# EAGLE board LiBatteryChargeBoostBoard (EAGLE 9.6.2)
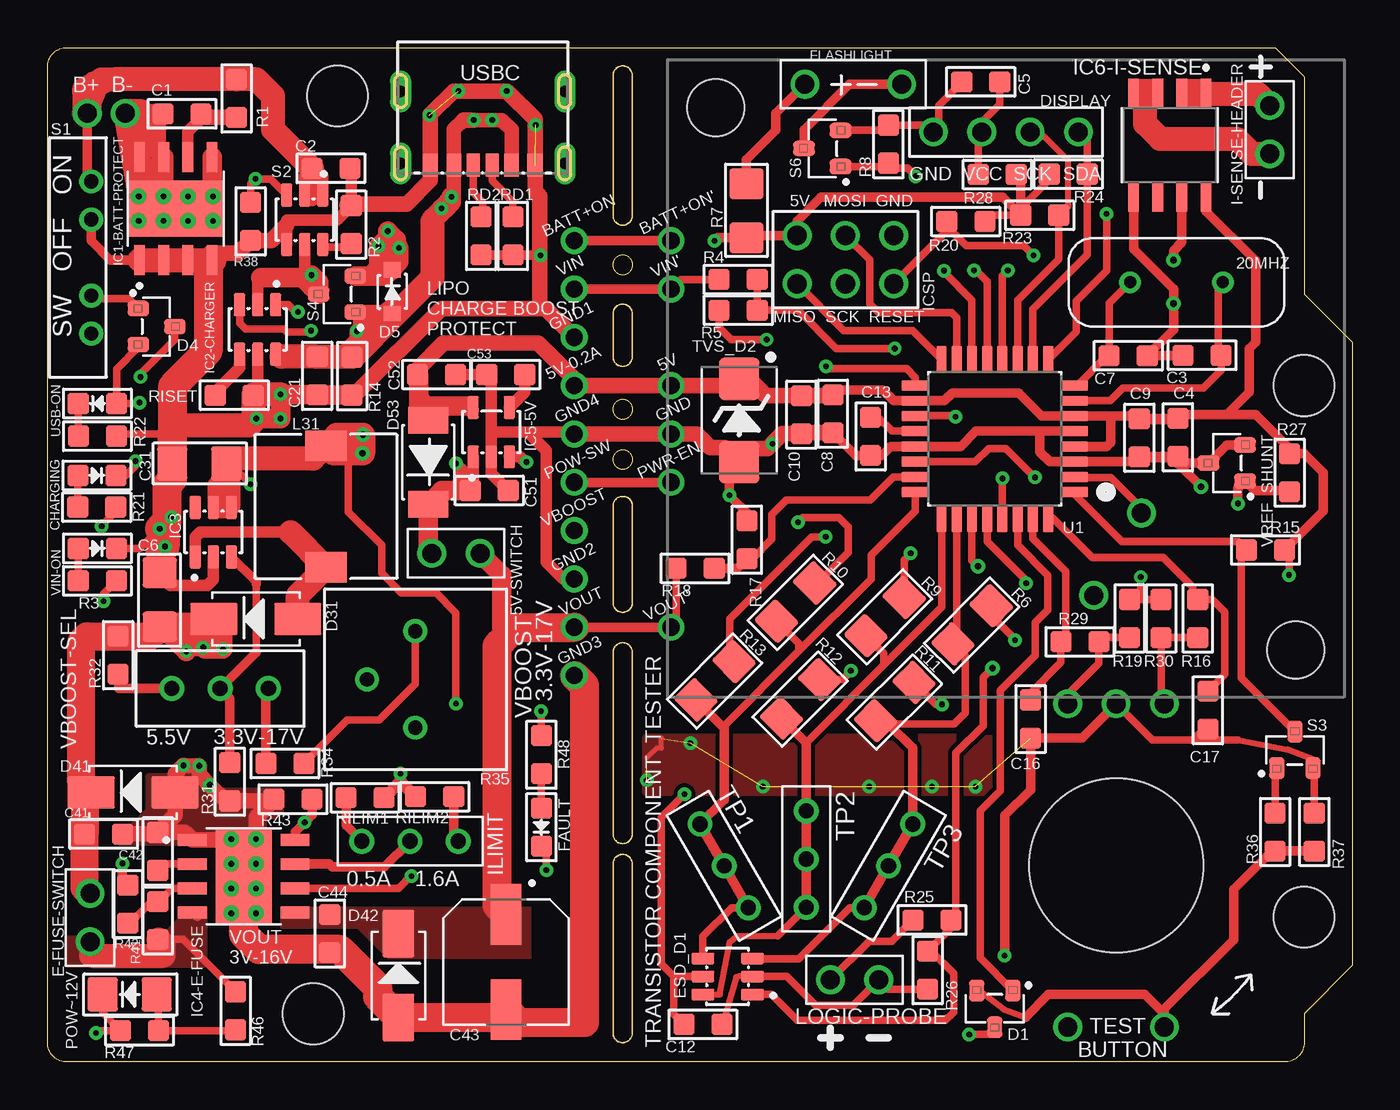
[diagram p1: board, top side]
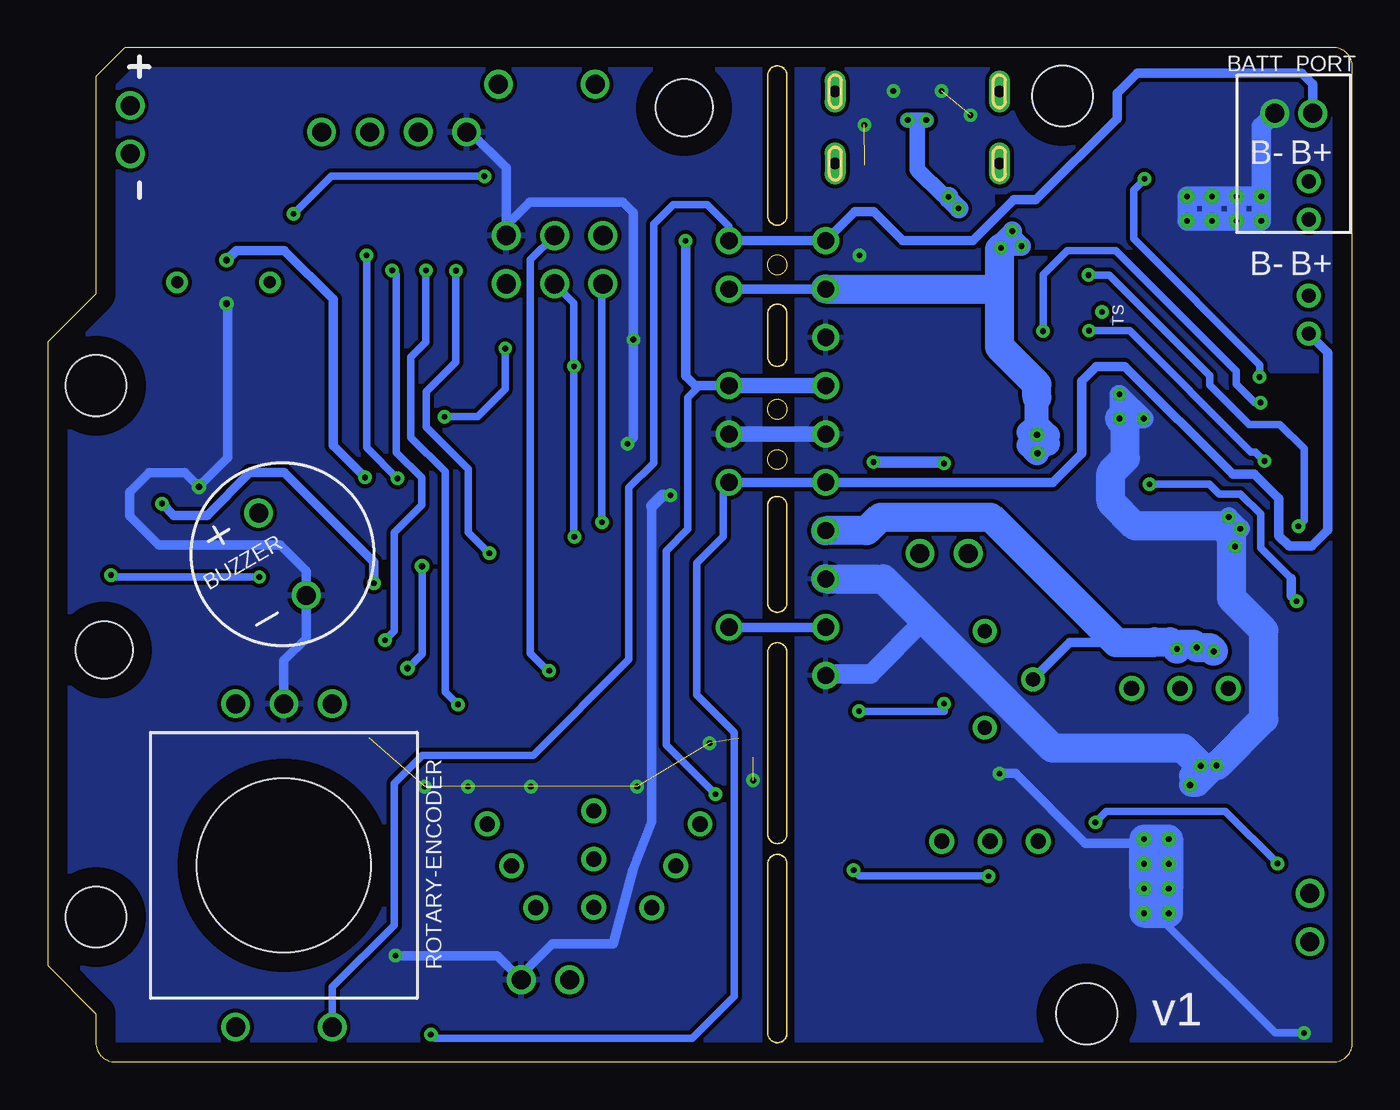
[diagram p2: board, bottom side, seen from below]

Size 68.58 x 53.34 mm. Coordinates in mm from the lower left corner, seen from the top.
Outline: 68.58,5.08 66.04,2.54 66.04,1.02 arc-90 65.02,0 1.02,0 arc-90 0,1.02 0,52.32 arc-90 1.02,53.34 64.52,53.34 66.04,51.82 66.04,40.39 68.58,37.85 68.58,5.08
Copper layers (1*16): Top 0.035mm / dielectric 1.5mm / Bottom 0.035mm
Design rules "default *": minimum track width 6mil, minimum drill 0.3mm, track to track 0.2mm, track to pad 0.2mm, pad to pad 0.2mm, via to via 10mil, smd to smd 0.2mm, copper to edge 40mil, drill to drill 0.5mm, minimum pad ring 10mil, minimum via ring 8mil, stop-mask expansion 4mil, vias tented up to drill 0mil, thermal gap 10mil
Net classes: 0 default: clearance 0.205 mm
Holes 3.2 mm at 15.24,50.8 13.97,2.54 66.04,7.62 66.04,35.56
tKeepout: area 13.2,48.8 to 17.2,52.8; area 12,0.5 to 16,4.5; area 64,5.6 to 68,9.6; area 64,33.6 to 68,37.6
bKeepout: area 13.2,48.8 to 17.2,52.8; area 12,0.5 to 16,4.5; area 64,5.6 to 68,9.6; area 64,33.6 to 68,37.6
Milling: area 29.7,33.8 to 30.7,34.8; area 29.7,31.2 to 30.7,32.2; area 29.7,41.4 to 30.7,42.4; 30 lines

## Footprints (pad centres in the part's own frame; a part is rotated, then mirrored left to right if it is on the bottom)
TEST-POINT-TH-1MM = drill 0.9: P$1 0,0
HEADER-2PIN-0.1"P = drill 1: 1 -1.27,0; 2 1.27,0
XTAL_ECS-200-18-4X-CKM = drill 0.63 pad 1.03: 1 -2.44,0; 2 2.44,0
S2B-PH-K-S = drill 1: N 0.984,-2.54; P -1.016,-2.54
BUZZER-ACTIVE-CMI-9605-0580T = drill 1: P$1 0,2.5; P$2 0,-2.5
0603 = smd 1.1 x 1.1: 1 -1,0; 2 1,0
1206 = smd 1.6 x 1.803: 1 -1.422,0; 2 1.422,0
CAP_EEEFN1E101UP = smd 3.2 x 1.6: 1 -2.5,0; 2 2.5,0
0603-DIODE = smd 1.1 x 1.1: A 1,0; C -1,0
SOT-23-3 = smd 0.8 x 1.13: 1 -0.95,-0.96; 2 0.95,-0.96; 3 0,0.96
SOD-323 = smd 0.8 x 0.9: A -1.16,-0.03; C 1.14,-0.03
SMA = smd 2.5 x 1.7: A -2.205,0; C 2.205,0
SOD-128 = smd 1.4 x 2.1: A -2.11,-0.06; K 2.29,-0.06
DISPLAY-1.3"-SH1106-I2C = drill 1: GND -3.81,-1.27; SCK 1.27,-1.27; SDA 3.81,-1.27; VCC -1.27,-1.27 | hole 3: -15.24,0; 15.24,-28.5
SOT-23-6 = smd 1.2 x 0.6: 1 -1.3,0.95; 2 -1.3,0; 3 -1.3,-0.95; 4 1.3,-0.95; 5 1.3,0; 6 1.3,0.95
HEADER-2PIN-0.2"P = drill 1: +VE -2.54,0; -VE 2.54,0
SOIC-8-POWER-PAD = smd 1.55 x 0.6: 1 -2.7,1.905; 2 -2.7,0.635; 3 -2.7,-0.635; 4 -2.7,-1.905; 5 2.7,-1.905; 6 2.7,-0.635; 7 2.7,0.635; 8 2.7,1.905 | smd 2.95 x 4.9: 9 0,0 | drill 0.3: 10 -0.65,1.95; 11 0.65,1.95; 12 -0.65,0.65; 13 0.65,0.65; 14 -0.65,-0.65; 15 0.65,-0.65; 16 -0.65,-1.95; 17 0.65,-1.95
SOT-23-5 = smd 1.2 x 0.6: 1 -1.3,0.95; 2 -1.3,0; 3 -1.3,-0.95; 4 1.3,-0.95; 5 1.3,0.95
SOIC-8 = smd 1.55 x 0.6: 1 -2.7,1.905; 2 -2.7,0.635; 3 -2.7,-0.635; 4 -2.7,-1.905; 5 2.7,-1.905; 6 2.7,-0.635; 7 2.7,0.635; 8 2.7,1.905
HEADER-ICSP-0.1"P = drill 1.016: GND 2.54,1.27; MISO -2.54,-1.27; MOSI 0,1.27; RESET 2.54,-1.27; SCK 0,-1.27; VCC -2.54,1.27
HEADER-3PIN-0.1"P = drill 0.8: 1 -2.54,0; 2 0,0; 3 2.54,0
INDUCTOR-SMRH74-220MT = smd 2.2 x 1.6: P$1 0,3.2; P$2 0,-3.2
1206-DIODE = smd 1.6 x 1.803: A 1.422,0; C -1.422,0
ROTARY-POTENTIOMETER-3386P = drill 0.75: 1 2.54,0; 2 0,-2.54; 3 -2.54,0
PEC12R-3217F-S0024 = drill 1: 1 -2.54,8.5; 2 2.54,8.5; A -2.54,-8.5; B 2.54,-8.5; C 0,-8.5 | hole 9.144: 0,0
CSS-1310MC = drill 0.75: 1 -4,0; 2 -2,0; 3 4,0; C 2,0
DIOM5336X244N = smd 2.22 x 2.13: A 2.19,0; C -2.19,0
TQFP32 = smd 1.47 x 0.55: 1 -4.17,2.8; 2 -4.17,2; 3 -4.17,1.2; 4 -4.17,0.4; 5 -4.17,-0.4; 6 -4.17,-1.2; 7 -4.17,-2; 8 -4.17,-2.8; 17 4.17,-2.8; 18 4.17,-2; 19 4.17,-1.2; 20 4.17,-0.4; 21 4.17,0.4; 22 4.17,1.2; 23 4.17,2; 24 4.17,2.8 | smd 0.55 x 1.47: 9 -2.8,-4.17; 10 -2,-4.17; 11 -1.2,-4.17; 12 -0.4,-4.17; 13 0.4,-4.17; 14 1.2,-4.17; 15 2,-4.17; 16 2.8,-4.17; 25 2.8,4.17; 26 2,4.17; 27 1.2,4.17; 28 0.4,4.17; 29 -0.4,4.17; 30 -1.2,4.17; 31 -2,4.17; 32 -2.8,4.17
USB-C-RECEPTABLE-1016435900011LF = smd 0.7 x 1.2: A5 -0.5,3.03; B5 0.5,3.03 | smd 0.76 x 1.2: A9 1.52,3.03; B9 -1.52,3.03 | smd 0.8 x 1.2: A12 2.75,3.03; B12 -2.75,3.03 | drill 0.6 pad 1.1 long: SH1 -4.32,2.95; SH2 4.32,2.95; SH3 -4.32,-0.85; SH4 4.32,-0.85
SLW-883935-2A-D = drill 0.8: 1 -2.54,0; 2 2.54,0; C 0,0

## Placement (x,y rotation side)
5V  TEST-POINT-TH  [TEST-POINT-TH-1MM]  32.77,35.56 0 top
5V-0.2A  TEST-POINT-TH  [TEST-POINT-TH-1MM]  27.69,35.56 70 top
5V-SWITCH  [HEADER-2PIN-0.1"P]  21.46,26.75 180 top
20MHZ  ECS-200-18-4X-CKM  [XTAL_ECS-200-18-4X-CKM]  59.33,41 0 top
BATT+ON  TEST-POINT-TH  [TEST-POINT-TH-1MM]  27.69,43.18 70 top
BATT+ON'  TEST-POINT-TH  [TEST-POINT-TH-1MM]  32.77,43.18 0 top
BATT_PORT  S2B-PH-K-S  [S2B-PH-K-S]  3.1,47.34 180 bottom
BUZZER  CMI-9605-0580T  [BUZZER-ACTIVE-CMI-9605-0580T]  56.24,26.7 30 bottom
C1  0.1uF  [0603]  7.07,49.85 180 top
C2  1uF  [0603]  14.89,46.99 180 top
C3  22pF  [0603]  60.68,37.16 0 top
C4  10uF  [0603]  59.41,32.84 270 top
C5  10uF  [0603]  49.05,51.54 180 top
C6  22uF-35V  [1206]  5.89,24.31 270 top
C7  22pF  [0603]  56.79,37.13 180 top
C8  100nF  [0603]  41.27,34.09 90 top
C9  100nF  [0603]  57.38,32.82 270 top
C10  10uF  [0603]  39.62,34.04 270 top
C12  10uF  [0603]  34.44,1.98 0 top
C13  1nF  [0603]  43.26,32.89 270 top
C16  100nF  [0603]  51.66,18.03 270 top
C17  100nF  [0603]  60.99,18.49 270 top
C21  1uF  [0603]  14.17,36.08 90 top
C31  22uF-15V  [1206]  7.98,31.47 0 top
C41  0.1uF  [0603]  2.95,11.99 180 top
C42  10nF  [0603]  5.79,11.07 270 top
C43  100uF  [CAP_EEEFN1E101UP]  24.1,5.26 270 top
C44  10uF  [0603]  14.83,6.76 90 top
C51  10uF-25V  [0603]  23.22,30.05 180 top
C52  10uF  [0603]  20.45,36.14 180 top
C53  10nFC0G  [0603]  24.08,36.14 0 top
CHARGING  BLUE  [0603-DIODE]  2.59,30.84 180 top
D1  PMBD6100  [SOT-23-3]  49.78,2.79 180 top
D4  PMBD6100  [SOT-23-3]  5.73,38.67 270 top
D5  CUS10S30  [SOD-323]  18.09,40.51 90 top
D31  SS34  [SMA]  10.95,23.29 180 top
D41  SMAJ15A  [SMA]  4.5,14.17 180 top
D42  SS34  [SMA]  18.44,4.55 90 top
D53  PMEG3010EP  [SOD-128]  20.07,31.62 270 top
DISPLAY  [DISPLAY-1.3"-SH1106-I2C]  50.37,50.16 0 top
E-FUSE-SWITCH  [HEADER-2PIN-0.1"P]  2.24,7.59 270 top
ESD_D1  SRV05-4MR6  [SOT-23-6]  35.74,4.5 180 top
FAULT  RED  [0603-DIODE]  25.96,12.34 90 top
FLASHLIGHT  HEADER-2PIN-0.2"P  [HEADER-2PIN-0.2"P]  42.34,51.41 0 top
GND  TEST-POINT-TH  [TEST-POINT-TH-1MM]  32.77,33.02 0 top
GND1  TEST-POINT-TH  [TEST-POINT-TH-1MM]  27.69,38.1 70 top
GND2  TEST-POINT-TH  [TEST-POINT-TH-1MM]  27.69,25.4 70 top
GND3  TEST-POINT-TH  [TEST-POINT-TH-1MM]  27.69,20.32 70 top
GND4  TEST-POINT-TH  [TEST-POINT-TH-1MM]  27.69,33.02 70 top
I-SENSE-HEADER  CES-102-02-G-S-RA  [HEADER-2PIN-0.1"P]  64.24,49.02 270 top
IC1-BATT-PROTECT  XB8089D  [SOIC-8-POWER-PAD]  6.74,44.87 90 top
IC2-CHARGER  BQ21040DB  [SOT-23-6]  11.04,38.52 270 top
IC3  MT3608  [SOT-23-6]  8.71,27.86 90 top
IC4-E-FUSE  TPS259630  [SOIC-8-POWER-PAD]  10.3,9.77 0 top
IC5-5V  LP2992IM5-5.0  [SOT-23-5]  23.32,33.12 90 top
IC6-I-SENSE  TMCS1108A4B  [SOIC-8]  58.98,48.21 270 top
ICSP  CES-103-01-T-D  [HEADER-ICSP-0.1"P]  41.94,42.19 0 top
ILIMIT  [HEADER-3PIN-0.1"P]  19.05,11.61 0 top
L31  22uH  [INDUCTOR-SMRH74-220MT]  14.63,29.21 0 top
LOGIC-PROBE  [HEADER-2PIN-0.1"P]  42.42,4.32 0 top
POW-SW  TEST-POINT-TH  [TEST-POINT-TH-1MM]  27.69,30.48 70 top
POW~12V  RED  [1206-DIODE]  4.32,3.56 0 top
PWR-EN  TEST-POINT-TH  [TEST-POINT-TH-1MM]  32.77,30.48 0 top
R1  1K  [0603]  9.94,50.67 90 top
R2  10K  [0603]  15.96,44.03 90 top
R3  3K3  [0603]  2.62,25.3 0 top
R4  10K  [0603]  36.3,41.15 0 top
R5  3K3  [0603]  36.3,39.52 180 top
R6  680  [1206]  48.59,22.99 225 top
R7  51  [1206]  36.73,44.75 90 top
R8  100K  [0603]  44.2,48.26 90 top
R9  680  [1206]  44.02,23.42 225 top
R10  680  [1206]  39.32,24.18 225 top
R11  470k  [1206]  44.53,18.95 225 top
R12  470k  [1206]  39.57,19.1 225 top
R13  470k  [1206]  35.08,20.04 225 top
R14  10K  [0603]  16,36.07 90 top
R15  100K  [0603]  64.01,26.92 180 top
R16  10K  [0603]  60.45,23.32 90 top
R17  3K3  [0603]  36.75,27.46 270 top
R18  10K  [0603]  34.04,25.96 180 top
R19  10K  [0603]  56.87,23.32 90 top
R20  10K  [0603]  48.26,44.2 180 top
R21  1K  [0603]  2.59,29.18 0 top
R22  620  [0603]  2.62,32.91 180 top
R23  3.3K  [0603]  52.15,44.53 180 top
R24  3.3K  [0603]  53.64,46.69 180 top
R25  10K  [0603]  46.48,7.47 180 top
R26  3.3K  [0603]  46.25,4.83 90 top
R27  10K  [0603]  65.28,30.99 270 top
R28  68R  [0603]  49.91,46.66 0 top
R29  10K  [0603]  54.25,22.1 180 top
R30  10K  [0603]  58.52,23.32 90 top
R31  2.2K  [0603]  9.58,14.73 270 top
R32  20K  [0603]  3.71,21.39 270 top
R34  10K-1%  [0603]  12.47,15.7 180 top
R35  50K  [ROTARY-POTENTIOMETER-3386P]  19.33,20.12 270 top
R36  10K  [0603]  64.52,12.09 270 top
R37  22K  [0603]  66.57,12.09 270 top
R38  7K5  [0603]  10.67,44.2 90 top
R41  82K5  [0603]  5.79,7.44 270 top
R42  38K3  [0603]  4.22,8.31 270 top
R43  10K  [0603]  12.9,13.82 0 top
R46  3K3  [0603]  9.88,2.69 90 top
R47  1K  [0603]  4.83,1.65 0 top
R48  470  [0603]  25.96,16.15 90 top
RD1  5K1-1%  [0603]  24.46,43.43 90 top
RD2  5K1-1%  [0603]  22.78,43.43 90 top
RILIM1  1K8-1%  [0603]  16.69,13.89 180 top
RILIM2  560-1%  [0603]  20.35,13.94 0 top
RISET  1K5-0.36A  [0603]  9.81,35.06 0 top
ROTARY-ENCODER  PEC12R-3217F-S0024  [PEC12R-3217F-S0024]  56.16,10.34 180 top
S1  POWER-SWITCH  [CSS-1310MC]  2.29,42.3 270 top
S2  TPS22995H  [SOT-23-6]  13.51,44.29 270 top
S3  BC847C  [SOT-23-3]  65.56,16.41 0 top
S4  DMP1045U  [SOT-23-3]  15.21,40.38 90 top
S6  AS2312  [SOT-23-3]  40.72,48.03 90 top
TP1  [HEADER-3PIN-0.1"P]  35.56,10.31 300 top
TP2  [HEADER-3PIN-0.1"P]  39.88,10.67 270 top
TP3  [HEADER-3PIN-0.1"P]  44.2,10.31 240 top
TVS_D2  SMBJP6KE6.8A  [DIOM5336X244N]  36.35,33.73 270 top
U1  ATMEGA328P-AU-TQFP  [TQFP32]  49.78,32.77 180 top
USB-ON  ORANGE  [0603-DIODE]  2.62,34.62 0 top
USBC  10164359-00011LF  [USB-C-RECEPTABLE-1016435900011LF]  22.87,50.19 180 top
VBOOST  TEST-POINT-TH  [TEST-POINT-TH-1MM]  27.69,27.94 70 top
VBOOST-SEL  [SLW-883935-2A-D]  9.07,19.63 0 top
VIN  TEST-POINT-TH  [TEST-POINT-TH-1MM]  27.69,40.64 70 top
VIN'  TEST-POINT-TH  [TEST-POINT-TH-1MM]  32.77,40.64 0 top
VIN-ON  GREEN  [0603-DIODE]  2.62,27 180 top
VOUT  TEST-POINT-TH  [TEST-POINT-TH-1MM]  27.69,22.86 70 top
VOUT'  TEST-POINT-TH  [TEST-POINT-TH-1MM]  32.77,22.86 0 top
VREF_SHUNT  LM4040AELT-2.5  [SOT-23-3]  61.98,31.5 90 top

## Tracks (layer width: path | path; a pad name or v marks a point on that pad's centre or on a via)
5V  (via drill 0.3)
  Top 0.406: R24.2 52.65,46.41 51.15,44.91 R23.2 49.59,44.53 R20.1 | R28.2 51.15,46.42 | R30.2 R19.2 57.08,24.32 57.45,24.69 v57.45,25.5 | R15.1 65.25,26.68 v65.25,25.6 | v33.48,14.09 32.26,12.87 32.26,5.16 32.92,4.5 | ESD_D1.5 32.92,4.5 | C12.1 32.92,2.5 32.92,4.5
  Top 0.508: 51.15,46.42 R23.2 50.21,45.47 40.64,45.47 39.4,44.22 ICSP.VCC 36.85,43.46 R7.1 35.2,43.33 v35.05,43.18 | 41.53,35.34 43.91,35.34 44.48,34.77 U1.18 47.14,34.77 47.54,35.17 51.05,35.17 52.25,33.97 U1.6 55.88,33.97 | 55.88,33.97 57.23,33.97 | 59.38,33.82 C4.1 59.6,34.04 61.98,34.04 | 65.1,31.81 R27.1 | D53.A 20.56,34.29 | 22.37,34.29 IC5-5V.5 22.09,34.7 | C52.2 19.45,35.24 | U1.4 55.67,32.37 55.88,32.57 55.88,33.97 | IC6-I-SENSE.8 60.88,44.75 63.5,42.13 63.5,37.84 63.17,37.51 63.17,35.23 61.98,34.04 | R15.1 67.06,28.97 67.06,30.99 66.06,31.99 R27.1 | R27.1 65.11,32.16 | R27.1 65.28,32.26 63.51,34.04 61.98,34.04
  Top 0.559: C8.2 41.53,35.34 | 57.23,33.97 C9.1 | C9.1 59.38,33.82 | 57.12,33.82 C9.1
  Top 0.61: 20.56,34.29 22.37,34.29 | 22.09,34.7 19.98,34.7 19.45,35.24
  Top 0.813: C8.2 41.22,35.04 C10.1 37.74,35.04 36.85,35.92 TVS_D2.C 35.99,35.56 5V.P$1 5V-0.2A.P$1 27.94,35.64 25.78,37.8 20.8,37.8 19.45,36.44 C52.2 | D53.A 19.5,34.24
  Top 1.016: 19.5,34.24 19.5,36.09 C52.2
  Bottom 0.406: v65.25,25.6 65.15,25.5 v57.45,25.5 | 5V.P$1 34.29,35.56 34.92,34.92 34.92,28.02 36.07,26.87 36.07,16.68 v33.48,14.09
  Bottom 0.508: v35.05,43.18 35.05,36.07 34.54,35.56 5V.P$1
  Bottom 0.813: 5V-0.2A.P$1 5V.P$1
!FLT  (via drill 0.3)
  Top 0.406: v19.13,9.78 19.1,9.78 18.46,9.13 IC4-E-FUSE.6 | FAULT.C 26.21,11.09 v26.21,10.08
  Bottom 0.406: v26.21,10.08 25.91,9.78 v19.13,9.78
+VE
  Top 0.406: LOGIC-PROBE.1 43.18,6.35 44.36,6.35 R25.2
A
  Top 0.406: ROTARY-ENCODER.A 58.52,19.02 R30.1 R16.1
AREF
  Top 0.406: U1.20 44.39,33.17 43.66,33.89 C13.1
B
  Top 0.406: ROTARY-ENCODER.B 53.62,19.33 55.25,20.96 R29.1 55.47,22.32 R19.1
BATT+  (via drill 0.3)
  Top 0.406: v2.85,28.17 2.85,28.21 3.59,28.95 R21.2
  Top 0.61: 13.11,41.25 13.51,41.66 S2.5 13.51,41.38 v13.87,41.38 | 11.2,41.25 11.04,41.09 IC2-CHARGER.2
  Top 1.016: S4.3 13.87,40.76 v13.87,41.38 | v13.87,41.38 13.74,41.25 13.38,41.25 | S4.3 13.38,41.25 | v13.87,41.38 14.25,41 S4.3 | 11.2,41.25 13.38,41.25
  Bottom 0.406: v13.87,41.38 12.78,41.38 7.49,36.09 7.49,35.59 5.44,33.53 3.81,33.53 2.54,32.26 2.54,28.47 v2.85,28.17
BATT-
  Top 0.406: 6.1,45.53 6.74,44.9 IC1-BATT-PROTECT.9 7.43,45.56 8.64,45.56
  Top 1.016: 6.04,49.88 C1.2 | C1.2 5.71,49.5 5.71,47.96 IC1-BATT-PROTECT.7 | IC1-BATT-PROTECT.8 4.83,47.42 5.44,46.81 6.1,47.47 IC1-BATT-PROTECT.7 | 6.59,45.26 6.1,45.26 6.1,45.53 | IC1-BATT-PROTECT.7 6.1,45.53 | 6.1,45.53 IC1-BATT-PROTECT.13 | IC1-BATT-PROTECT.11 4.83,45.56 IC1-BATT-PROTECT.8 | IC1-BATT-PROTECT.8 4.83,49.88 C1.2 | IC1-BATT-PROTECT.5 8.64,45.56 IC1-BATT-PROTECT.17 | IC1-BATT-PROTECT.9 7.13,45.26
  Top 1.27: BATT_PORT.N 4.83,45.56
  Top 1.524: BATT_PORT.N 4.83,49.88
  Bottom 1.016: BATT_PORT.N 4.79,49.18 IC1-BATT-PROTECT.11 | IC1-BATT-PROTECT.11 IC1-BATT-PROTECT.13 | IC1-BATT-PROTECT.13 IC1-BATT-PROTECT.15 | IC1-BATT-PROTECT.15 IC1-BATT-PROTECT.17 IC1-BATT-PROTECT.16 IC1-BATT-PROTECT.14 | IC1-BATT-PROTECT.14 IC1-BATT-PROTECT.15 | IC1-BATT-PROTECT.14 IC1-BATT-PROTECT.12 | IC1-BATT-PROTECT.12 IC1-BATT-PROTECT.10 IC1-BATT-PROTECT.11 | IC1-BATT-PROTECT.13 IC1-BATT-PROTECT.12
  pour Bottom (no thermals): -0.2,54.15 -0.2,36.25 4.27,36.25 10.77,42.75 17.91,42.75 18.06,42.9 18.06,45.26 16.46,45.26 12.37,49.35 12.37,54.36 0,54.36
BATT_EN  (via drill 0.3)
  Top 0.406: D4.3 6.7,37.98 4.88,36.16 v4.88,36.02 | S2.3 11.72,46.43 v10.92,46.43 10.67,46.18 R38.2
  Bottom 0.406: v10.92,46.43 11.51,45.85 11.51,43.28 4.88,36.65 v4.88,36.02
BATTP_ALWAYS_ON
  Top 0.508: BATT_PORT.P 2.08,46.51 S1.1 | BATT+ON.P$1 BATT+ON'.P$1 | C2.2 14.08,46.99
  Top 0.61: 13.87,45.49 14.36,45.49 S2.1 14.46,46.6 14.08,46.99 | 13.87,45.59 S2.2 13.51,46.6 C2.2
  Top 1.016: R1.2 | 3.51,51.66 2.06,51 | BATT_PORT.P 2.75,51.46 2.84,51.66 | C2.2 13.87,46.96 13.87,45.59 13.87,45.49
  Top 1.27: 2.06,51.08 2.44,51.46 2.75,51.46 | 2.84,51.66 3.51,51.66 R1.2 | R1.2 10.97,51.67 11.84,50.8 11.84,49.04 C2.2
  Top 1.524: BATT_PORT.P 2.06,49.91 2.06,51 2.06,51.08
  Bottom 0.406: BATT+ON'.P$1 32.77,43.94 33.91,45.09 35.69,45.09 36.73,44.04 36.73,31.5 38.02,30.2 38.02,21.16 43.05,16.13 48.9,16.13 50.37,14.66 50.37,7.19 53.62,3.94 ROTARY-ENCODER.2
  Bottom 0.508: BATT_PORT.P 2.08,51.42 2.67,52 11.3,52 12.37,50.94 12.37,49.61 16.64,45.34 17.8,45.34 19.96,43.18 23.62,43.18 25.15,44.7 26.16,44.7 BATT+ON.P$1 BATT+ON'.P$1
BJT-B
  Top 0.406: R36.1 64.52,15.36 S3.1
BUZZER
  Top 0.406: 53.99,30.73 55.88,30.73 57.49,29.13 BUZZER.P$1
  Top 0.508: U1.2 53.99,30.73
BYP1
  Top 0.61: IC5-5V.4 25.08,35.23 C53.2
CHG  (via drill 0.3)
  Top 0.406: IC2-CHARGER.3 10.09,38.86 10.41,38.53 12.45,38.53 12.6,38.37 13.76,38.37 v13.84,38.46 | CHARGING.C 4.1,30.84 4.62,31.36 v4.62,31.6
  Bottom 0.406: v13.84,38.46 11.71,38.46 5.33,32.08 5.11,32.08 v4.62,31.6
DISPLAY_VCC
  Top 0.406: R28.1 48.91,48.71 DISPLAY.VCC 49.1,49.4 50.05,50.35 C5.1
DVDT
  Top 0.406: C42.2 6.12,10.4 IC4-E-FUSE.2
EN/UVLO
  Top 0.406: IC4-E-FUSE.3 6.54,9.13 5.85,8.44 R41.1 5.49,8.44 4.35,7.31 R42.2
ENC_A
  Top 0.406: U1.32 52.84,28.6 54.92,26.52 58.65,26.52 60.2,24.97 60.2,24.57 R16.2 61.21,24.32 61.87,23.66 61.87,20.38 C17.1
ENC_B
  Top 0.406: U1.31 51.78,27.52 53.51,25.79 53.51,22.35 R29.2 53.25,21 51.66,19.41 C16.1
FB
  Top 0.406: 10.97,25.15 10.97,21.54
  Top 0.508: R31.1 9.58,19.13 VBOOST-SEL.C 10.97,21.54 | IC3.3 10.97,25.25 10.97,25.15
FL+
  Top 0.508: FLASHLIGHT.+VE 38.28,49.89 38.28,48.99 36.73,47.44 R7.2
FL-
  Top 0.508: S6.3 39.76,49.03 42.14,51.41 FLASHLIGHT.-VE
FLASHLIGHT_SIGNAL  (via drill 0.3)
  Top 0.406: S6.1 44.02,47.08 R8.1 44.45,47.01 45.2,47.01 v45.63,46.58 | U1.9 54.06,38.41 54.06,40.01 55.66,41.62 v55.66,44.59
  Bottom 0.406: v55.66,44.59 53.67,46.58 v45.63,46.58
GND  (via drill 0.3, 0.35)  (9 unrouted)
  Top 0.254: 32.26,17.02 32.26,16.51 32,16.51 31.5,16
  Top 0.305: C4.2 59.41,31.94 | ESD_D1.2 36.3,4.5 36.19,4.46 35.52,2.11 C12.2 | S3.2 66.51,15.91 65.13,16.43 62.55,16.93
  Top 0.406: R22.1 3.72,33.01 6.21,33.01 6.55,32.66 C31.1 | C5.2 48.05,51.51 46.83,50.29 46.83,49.16 DISPLAY.GND 46.19,49.26 R8.2 43.92,48.98 S6.2 | ROTARY-ENCODER.C 58.06,16.93 60.2,16.93 | ESD_D1.2 38.86,4.5 40.39,2.97 42.34,2.97 LOGIC-PROBE.2 44.18,3.83 R26.1 | POW~12V.C 2.9,2.58 R47.1 2.67,1.65 v2.54,1.52 | R5.2 35.3,38.62 35.93,37.98 v37.8,37.98 | VIN-ON.C 4.85,27 v5.89,28.04 | R37.1 66.57,15.38 S3.2 | 60.2,16.93 62.55,16.93 | 60.2,16.93 60.76,17.49 C17.2
  Top 0.508: S1.2 2.29,43.17 3.3,42.17 IC1-BATT-PROTECT.1 | 59.38,31.82 C4.2 | C9.2 57.13,31.57 U1.3 52.66,31.57 52.15,32.08 52.15,33.17 | v50.29,5.59 50.32,5.61 50.32,12.96 51.66,14.31 C16.2 54.37,17.03 ROTARY-ENCODER.C | 5.89,25.6 C6.1 | C8.1 42.47,31.89 C13.2 43.83,31.89 44.3,32.37 U1.21 47.99,32.37 48.79,33.17 52.15,33.17 | 15.96,46.92 C2.1 | RD1.1 25.86,42.43 | RD1.1 RD2.1 | R17.1 36.93,28.71 v35.84,29.79 35.84,31.03 TVS_D2.A | RD1.1 25.89,42.43 v25.91,42.42 | C4.2 59.44,31.82 59.44,31.45 v60.63,30.25 | C3.1 59.66,37.13 C7.1 59.18,38.52 v59.18,39.88 59.18,40.64 57.07,42.75 IC6-I-SENSE.5 | U1.5 52.15,33.17 | C4.2 59.76,31.5 VREF_SHUNT.3 61.97,32.45 VREF_SHUNT.2
  Top 0.559: C9.2 59.38,31.82
  Top 0.61: S2.4 12.56,43.99 12.56,44.27 15.21,44.27 R2.2 | IC2-CHARGER.5 11.04,35.28 10.83,35.08 | IC3.2 8.71,25.38 8.38,25.04 6.45,25.04 5.89,25.6 | C51.1 23.32,30.95 IC5-5V.2 23.32,33.12 | GND2.P$1 27.1,25.4 26.21,26.29 26.21,32.16 25.25,33.12 | RILIM1.1 18.54,14.75 | 18.54,14.75 v18.54,15.16 | RILIM2.1 18.54,14.75 | 23.32,33.12 25.25,33.12 | 25.25,33.12 27.84,33.12 GND4.P$1 | 15.73,45.05 15.71,45.03 R2.2 | R2.2 15.96,46.92 | 23.32,33.12 23.32,35.91 C53.1 C52.1
  Top 0.762: 6.55,33.22 6.81,33.48
  Top 0.813: IC1-BATT-PROTECT.4 9,42.52 10,42.52 R38.1 11.77,43.2 12.56,43.99 | C8.1 39.67,33.09 C10.2 38.62,33.04 v38.1,32.51 37.85,32.26 37.06,32.26 TVS_D2.A 35.59,32.3 34.82,32.3 34.11,33.02 GND.P$1 GND4.P$1 | GND1.P$1 27.71,38.1 26.19,39.62 25.86,39.62 | 25.86,39.62 25.86,42.43 25.86,45.52 25.62,45.75 USBC.B12 25.62,49.56 v24.13,51.05 v21.59,51.05 21.34,51.05 20.12,49.84 USBC.A12 20.12,46.36 18.87,45.11 15.79,45.11 15.73,45.05 | R14.1 16.13,35.07 20.68,39.62 25.86,39.62 | IC4-E-FUSE.11 10.96,12.87 R43.1 11.82,13.73 R31.2 9.36,13.73 v8.53,14.55 7.98,15.11 v7.98,15.57 v7.14,15.6 6.7,15.16 D41.A 6.7,12.98 C42.1 | C41.1 5.71,11.99 C42.1 | C42.1 7.21,12.07 IC4-E-FUSE.1 9.61,11.68 IC4-E-FUSE.10
  Top 1.016: IC4-E-FUSE.9 IC4-E-FUSE.14 | 10.3,8.47 IC4-E-FUSE.16 | 11.1,5.92 11.26,5.76 C44.1 14.99,5.92 15.37,5.92 | v10.97,33.83 v12.24,33.83 v12.24,35.1 14.15,35.1 C21.1 R14.1
  Top 1.27: IC1-BATT-PROTECT.1 IC1-BATT-PROTECT.2 IC1-BATT-PROTECT.3 IC1-BATT-PROTECT.4 | 10.83,35.08 RISET.2 | 6.81,33.48 10.62,33.48 v10.97,33.83 10.83,33.98 10.83,35.08 | v12.24,35.1 10.86,35.1 10.83,35.08
  Top 1.524: IC1-BATT-PROTECT.4 8.44,41.97 8.44,37.4 6.55,35.51 C31.1 | C31.1 6.55,33.22 | C31.1 6.55,30.63 6.27,30.35 6.27,28.42 v5.89,28.04 6.17,27.76 v6.17,27.1 5.92,26.85 5.92,25.75 C6.1 | GND3.P$1 28.23,19.78 28.23,2.07 24.79,2.07 C43.2 23.69,2.34 D42.A 17.35,3.43 17.35,3.94 15.37,5.92 11.1,5.92 10.3,6.71 10.3,8.47 IC4-E-FUSE.15
  Bottom 0.406: v2.54,1.52 4.06,1.52 9.65,7.12 IC4-E-FUSE.16
  Bottom 0.508: IC4-E-FUSE.11 11.18,11.49 14.03,11.49 17.7,15.16 v18.54,15.16 | DISPLAY.GND 46.35,48.9 44.48,47.02 ICSP.GND 44.48,43.97 43.23,45.21 38.35,45.21 37.8,44.65 v37.8,37.98 37.8,32.82 v38.1,32.51 | ROTARY-ENCODER.C 56.16,21.11 54.99,22.28 BUZZER.P$2 54.99,25.8 56.36,27.18 62.74,27.18 64.26,28.7 64.26,29.97 63.25,30.99 61.37,30.99 v60.63,30.25 59.11,31.77 59.11,39.8 v59.18,39.88 | 36.83,29.23 36.83,12.63 37.8,10.16 38.86,6.22 42.05,6.22 43.69,4.59 LOGIC-PROBE.2 44.96,5.59 v50.29,5.59
  Bottom 0.61: v35.84,29.79 36.27,29.79 36.83,29.23
  Bottom 0.813: GND4.P$1 GND.P$1
  Bottom 1.016: 6.6,27.69 6.6,28.19 6.6,28.55 v6.5,28.65 v5.89,28.04 6.17,27.76 v6.17,27.1 6.68,27.61 6.6,27.69 | 6.6,27.69 6.35,27.94 | 11.94,33.53 11.63,33.83 v10.97,33.83 v12.24,35.1 v12.24,33.83 | 22.49,23.23 25.32,20.39 27.61,20.39 GND3.P$1
  Bottom 1.27: v7.98,15.57 8.48,15.06 8.48,14.58 8.15,14.58 v7.14,15.6
  Bottom 1.524: v7.14,15.6 7.11,15.57 4.65,18.03 4.65,22.68 6.35,24.38 6.35,27.94 | v7.98,15.57 8.91,16.51 15.77,16.51 22.49,23.23 24.66,25.4 GND2.P$1 | IC4-E-FUSE.14 IC4-E-FUSE.16 IC4-E-FUSE.17 IC4-E-FUSE.15 | IC4-E-FUSE.14 IC4-E-FUSE.15 | IC4-E-FUSE.15 IC4-E-FUSE.13 | IC4-E-FUSE.13 IC4-E-FUSE.11 IC4-E-FUSE.10 IC4-E-FUSE.12 | IC4-E-FUSE.12 IC4-E-FUSE.13 | IC4-E-FUSE.12 IC4-E-FUSE.14 | v12.24,33.83 11.94,33.53 11.94,31.75 12.7,30.99 12.7,29.46 11.43,28.19 6.6,28.19
  other vias: 31.5,14.81 33.78,16.76 37.59,14.48 43.18,14.48 46.48,14.48 48.77,14.48 20.07,49.78 25.65,49.28
  pour Bottom: 29.21,54.36 29.21,-1.27 28.96,-1.52 -0.51,-1.52 -1.02,-1.02 -1.02,35.87 4.35,35.87 10.72,42.24 18.62,42.24 18.84,42.46 18.9,45.75 16.81,45.8 12.88,49.73 12.88,54.36
  pour Bottom: 31.17,54.13 31.17,0.33 32.51,-1.02 70.87,-1.02 70.87,54.13
  pour Top (no thermals): 3.81,12.19 4.32,12.19 5.33,13.21 5.33,14.99 6.35,14.99 6.6,15.24 7.87,15.24 7.87,14.99 8.64,14.22 12.19,14.22 12.19,13.21 11.94,12.95 11.33,12.95 11.33,11.58 3.81,11.58
  pour Top: 31.5,17.02 31.5,14.48 49.78,14.48 49.78,17.02
  pour Top: 31.5,17.02 31.5,14.22 50.04,14.22 50.04,17.02
I2C-SCL
  Top 0.305: 52.15,48.9 53.62,47.42 53.62,45
  Top 0.406: DISPLAY.SCK 52.15,48.9 | 53.62,45 R23.1 53.15,42.22 50.98,40.06 U1.11
I2C-SDA
  Top 0.406: DISPLAY.SDA 54.65,48.43 R24.1 54.65,42.45 51.78,39.59 U1.10
I_MEASURE  (via drill 0.3, 0.35)
  Top 0.406: U1.22 48.77,31.57 49.46,32.26 50.37,32.26 v51.89,30.73
  Top 0.508: v59.18,42.16 59.18,42.67 59.61,43.1 IC6-I-SENSE.7
  Bottom 0.508: v51.89,30.73 53.57,32.41 53.57,40.11 56.13,42.67 58.67,42.67 v59.18,42.16
ILM
  Top 0.508: ILIMIT.2 17.7,10.25 14.96,10.25 14.81,10.4 IC4-E-FUSE.7
ILM1
  Top 0.508: ILIMIT.1 15.69,12.43 RILIM1.2
ILM2
  Top 0.508: RILIM2.2 21.34,11.85 ILIMIT.3
IN+
  Top 0.508: 60.86,50.94 IC6-I-SENSE.1 60.88,51.44 59.61,51.44 IC6-I-SENSE.2 59.64,50.94 60.86,50.94
  Top 0.61: IC6-I-SENSE.1 60.88,50.63 60.68,50.43 59.74,50.43 59.61,50.55 IC6-I-SENSE.2
  Top 1.27: IC6-I-SENSE.1 63.62,50.91 I-SENSE-HEADER.1
IN-
  Top 0.61: 57.68,51.06 57.68,50.91 IC6-I-SENSE.4 57.07,51.4 58.34,51.4 IC6-I-SENSE.3
  Top 1.27: I-SENSE-HEADER.2 63.3,47.75 62.51,48.54 58.47,48.54 57.68,49.33 57.68,51.06
ISET
  Top 0.61: RISET.1 8.81,35.23 10.09,36.5 IC2-CHARGER.4
N$1
  Top 0.406: USBC.B5 22.37,45.7 22.86,45.21 22.86,44.51 RD2.2
N$2
  Top 0.406: USBC.A5 23.37,46.33 24.46,45.24 RD1.2
N$3
  Top 0.406: USB-ON.C R22.2
N$4
  Top 0.508: VBOOST-SEL.1 3.73,19.63 R32.2
N$5
  Top 0.406: R3.1 VIN-ON.A
N$7
  Top 0.406: R48.1 FAULT.A
N$10
  Top 0.406: CHARGING.A R21.1
N$13
  Top 0.508: R34.2 11.47,19.5 VBOOST-SEL.2
N$18
  Top 0.406: POW~12V.A 5.83,3.47 R47.2 9.84,1.65 R46.1
N$21
  Top 0.406: R34.1 15.76,17.98 17.42,17.98 19.33,19.89 R35.3
OVLO  (via drill 0.3)
  Top 0.406: R42.1
  Top 0.508: v3.94,10.44 3.94,9.59 R42.1 | IC4-E-FUSE.8 13.01,12.09 v13.51,12.6 13.9,12.99 R43.2
  Bottom 0.406: v3.94,10.44 6.68,13.18 12.93,13.18 v13.51,12.6
POWER_EN_SOFT  (via drill 0.3)
  Top 0.406: v48.44,1.45 49.45,1.45 49.45,1.5 D1.3
  Top 0.508: POW-SW.P$1 PWR-EN.P$1
  Bottom 0.406: PWR-EN.P$1 33.07,30.18 33.07,27.64 34.47,26.24 34.47,19.3 32.49,17.32 32.49,3.46 34.71,1.24 48.23,1.24 v48.44,1.45
  Bottom 0.508: S1.3 1.29,37.31 1.29,27.96 2.13,27.13 3.33,27.13 3.86,27.66 3.86,29.62 5.16,30.91 6.3,30.91 11.96,36.58 13.46,36.58 14.22,35.81 14.22,32 15.75,30.48 POW-SW.P$1 PWR-EN.P$1
POWER_EN_TB
  Top 0.305: D1.2 49,3.75 50.27,2.77 51.4,2.35
  Top 0.508: R37.2 R36.2 64.35,11.09 62.33,9.07 62.33,6.43 58.7,2.79 ROTARY-ENCODER.1 58.7,2.52 57.67,3.56 52.6,3.56 51.4,2.35
PWR_CTRL
  Top 0.406: U1.30 50.98,27.17 52.58,25.58 52.58,23.77 51.92,23.11 51.92,21.39 50.06,19.53 50.06,14.25 49.02,13.21 49.02,5.47 D1.1
PWR_SW
  Top 0.406: D4.1 4.27,40.13 2.47,40.13 S1.C
RESET  (via drill 0.3)
  Top 0.406: ICSP.RESET 47.26,43.7 R20.2 47.26,43.94 48.28,42.93 51.31,42.93 v51.82,42.42 | v50.19,30.68 v50.18,30.68 U1.29
  Bottom 0.406: v51.82,42.42 51.82,32.31 v50.19,30.68
RT
  Top 0.406: R2.1 15.77,42.84 14.62,42.84 S2.6
SW
  Top 0.61: IC3.1 7.76,27.61 8.02,27.86 12.78,27.86
  Top 1.27: 12.78,27.86 L31.P$2 13.15,24.53 D31.A
TEST_BUTTON
  Top 0.406: S3.3 62.74,20.19 62.74,26.55 63.01,26.82 R15.2 62.57,27.36 56.46,27.36 53.95,29.87 U1.1
TP1
  Top 0.406: R10.2 39.48,22.01 39.48,21.6 | 39.48,21.6 43.28,25.4 43.28,26.64 45.61,28.98 U1.24 | ESD_D1.4 34.44,6.6 35.95,8.11 TP1.3 | 39.48,21.6 35.56,17.68
  Top 0.508: 35.56,17.55 35.56,13.78 TP1.1 TP1.2 TP1.3 | 35.56,17.55 35.56,17.68 | 35.56,17.55 R13.2
TP1_470K/SCK  (via drill 0.3)
  Top 0.406: R13.1 35.85,21.27 35.85,23.31 40.16,27.61 v40.89,27.61 | U1.17 45.61,36 45.16,36.45 41.05,36.45 v40.92,36.58
  Bottom 0.406: ICSP.SCK 40.92,39.9 v40.92,36.58 40.92,27.64 v40.89,27.61
TP1_680/MISO  (via drill 0.3)
  Top 0.406: U1.16 45.46,38.46 41.85,38.46 ICSP.MISO | v39.45,28.37 39.7,28.63 41.58,28.63 42.08,28.13 42.08,26.79 40.48,25.19 R10.1
  Bottom 0.406: ICSP.MISO 39.45,40.87 v39.45,28.37
TP2
  Top 0.305: 38.38,6.63 36.25,6.63 35.85,6.3 35.34,3.55 ESD_D1.6
  Top 0.406: R9.2 43.95,21.47 43.95,20.89 | 43.95,20.89 43.95,20.86 39.88,16.79 | 43.95,20.89 46.98,23.92 U1.25 | 38.38,6.63 TP2.3
  Top 0.508: TP2.3 TP2.2 TP2.1 39.88,16.79 | 39.88,16.79 | 39.88,16.79 R12.2
TP2_470K/MOSI  (via drill 0.3)
  Top 0.406: U1.15 47.78,39.13 47.52,39.4 43.69,39.4 43.2,39.88 43.2,42.19 ICSP.MOSI | v42.22,20.57 42.22,20.52 41.8,20.11 R12.1
  Bottom 0.406: ICSP.MOSI 43.2,42.19 43.2,21.49 42.29,20.57 v42.22,20.57
TP2_680/SIGNAL_OUT  (via drill 0.3)
  Top 0.406: v45.36,26.75 45.02,26.41 R9.1 | v47.12,41.6 47.12,41.53 48.58,40.06 U1.14
  Bottom 0.406: v47.12,41.6 47.12,36.8 48.67,35.26 48.67,33.38 46.47,31.18 46.47,27.85 v45.36,26.75
TP3
  Top 0.406: U1.26 47.78,28.59 47.78,22.17 R6.2 48.22,21.35 48.22,18.35 47.65,17.78 44.2,17.78 | TP3.3 42.15,8.11 39.47,5.44 37.05,5.44 ESD_D1.3
  Top 0.508: TP3.3 TP3.2 TP3.1 45.47,16.51 44.2,17.78 44.03,17.94 R11.2
TP3_470K  (via drill 0.3)
  Top 0.406: R11.1 46.69,18.8 v47.02,18.8 | v48.69,41.63 48.79,41.63 49.38,41.04 U1.13
  Bottom 0.406: v47.02,18.8 47.69,19.47 47.69,31.05 49.48,32.84 49.48,37.06 48.69,37.85 v48.69,41.63
TP3_680  (via drill 0.3)
  Top 0.406: R6.1 49.6,23.48 50.85,22.23 v50.85,22.17 | U1.12 50.18,41.34 v50.47,41.63
  Bottom 0.406: v50.47,41.63 50.24,41.4 50.24,32.05 48.92,30.73 48.92,29.29 50.37,27.84 50.37,22.66 v50.85,22.17
TP_LOGIC  (via drill 0.35)
  Top 0.406: v49.66,20.7 49.17,20.22 49.17,17.68 47.74,16.24 47.74,7.72 R25.1 47.48,7.05 R26.2 46.46,5.83 47.62,4.66 47.62,2.62 47.19,2.18 39.4,2.18 38.03,3.55 ESD_D1.1 | U1.27 48.58,26.37 v48.9,26.06
  Bottom 0.406: v48.9,26.06 48.9,21.46 v49.66,20.7
TS  (via drill 0.3)
  Top 0.406: IC2-CHARGER.1 12.66,39.82 13.03,39.45 v13.16,39.45
USBV  (via drill 0.3)
  Top 0.406: D4.2 4.78,37.58 3.63,36.44 3.63,34.64 USB-ON.A 4.78,34.62 v4.83,34.67
  Top 0.61: IC2-CHARGER.6 12.03,37.18 12.19,37.18
  Top 0.762: 21.84,49.53 21.35,49.04 USBC.A9 21.35,45.62 v21.22,45.49 | v22.4,49.53 v23.37,49.53 23.88,49.53 24.39,49.02 USBC.B9 | 18.04,39.43 S4.1 16.42,39.17 16.42,38.6 v16.26,38.43 16.26,37.32 R14.2 16,37.23
  Top 0.813: 21.84,49.53 v22.4,49.53
  Top 1.016: 12.29,37.08 12.19,37.18 | 21.22,45.2 20.9,44.88 v20.7,44.88 | 21.22,45.2 v21.22,45.49 | v20.7,44.88 21.02,45.2 21.22,45.2 | v20.7,44.88 20.7,44.68 20.22,44.2 20.22,44.4 v20.7,44.88
  Top 1.27: 12.29,37.08 C21.2 14.18,37.07 R14.2 | 20.22,44.2 20.22,41.25 18.32,39.35 D5.A 18.04,39.43
  Top 1.524: D5.A 16,37.23
  Bottom 0.406: v4.83,34.67 5.13,34.67 6.1,35.64 6.1,36.32 12.45,42.67 14.99,42.67 16.26,41.4 v16.26,38.43
  Bottom 0.813: v20.7,44.88 21.31,45.49 | 21.31,45.49 21.39,45.57 21.51,45.57 22.86,46.91 22.86,49.53 | 22.86,49.53 v23.37,49.53 v22.4,49.53 22.86,49.53 | v21.22,45.49 21.31,45.49
  Bottom 1.016: v21.22,45.49 21.22,45.4 v20.7,44.88
VBATT_MEASURE  (via drill 0.3)
  Top 0.406: v44.53,37.52 41.45,37.52 39.45,39.52 R5.1 R4.2 | v47.72,33.93 47.67,33.98 45.62,33.98 U1.19
  Bottom 0.406: v44.53,37.52 44.53,35.38 45.98,33.93 v47.72,33.93
VBOOST  (via drill 0.3)
  Top 0.61: 5.99,22.89 5.98,22.87
  Top 1.016: D31.C 8.74,22.2 v9.22,21.72 | v9.22,21.72 8.26,21.72 v8.18,21.79 8.13,21.84 7.54,21.84 v7.29,21.59 5.99,22.89 | v9.22,21.72 9.22,23.19 9.4,23.37 8.82,23.37 8.34,22.89
  Top 1.473: D41.C 1.78,14.69 1.78,22.1 2.07,22.39 R32.1 5.39,22.39 C6.2 | 1.95,13.83 C41.2 1.93,11.97 1.93,9.17 E-FUSE-SWITCH.1
  Top 1.524: D31.C 8.34,22.89 5.99,22.89 C6.2 5.88,22.87 | D41.C 1.95,13.83
  Bottom 0.508: 12.42,22.05 14.86,22.05 R35.2
  Bottom 1.524: VBOOST.P$1 25.53,27.94 24.82,28.65 19.02,28.65 12.42,22.05 10.46,22.05 10.41,22.1 9.6,22.1 v9.22,21.72 8.97,21.97 8.36,21.97 v8.18,21.79 7.49,21.79 v7.29,21.59
VBOOST2
  Top 0.406: R46.2 7.13,6.44 5.84,6.44
  Top 0.508: 7.87,7.64 7.87,7.87 7.61,7.87 IC4-E-FUSE.4
  Top 1.016: R41.2 5.84,6.44 5.99,6.44
  Top 1.27: E-FUSE-SWITCH.2 2.29,6.27 2.29,5.59 6.1,5.59 6.1,6.19 5.84,6.44
  pour Top (no thermals): 6.86,8.13 8.36,8.13 8.36,5.13 8.23,5 0.28,5 0.28,6.6 1.85,6.6 2.57,5.89 5.13,5.77 6.88,7.52 6.86,7.52
VDD
  Top 0.61: C1.1 8.06,49.6 7.37,48.91 IC1-BATT-PROTECT.6
  Top 0.813: R1.1 8.25,49.67 C1.1
VIN  (via drill 0.3, 0.35)
  Top 0.406: v16.56,32 16.05,32 15.8,31.75 15.8,28.93 17.55,27.18 17.55,25.7 18.59,24.66 20.42,24.66 21.46,23.62 v21.46,18.85 | R4.1 33.27,41.15 VIN'.P$1 | R48.2 25.96,18.41 v25.93,18.44 | v2.95,24.23 2.95,24.63 R3.2 | v10.67,30.38 9.68,31.37 9.5,31.37
  Top 0.508: VIN.P$1 VIN'.P$1
  Top 0.61: C31.2 9.4,31.06 8.71,30.38 IC3.5 9,28.88 9.42,28.88 9.71,29.16 IC3.4 9.61,29.16
  Top 0.762: 9.61,29.16 9.5,29.28
  Top 1.016: v16.56,32 16.59,32 | 15.04,32 L31.P$1 | D5.C 18.07,41.65 17.75,41.33 S4.2 16.93,41.33 17.4,41.79 v17.4,42.9 | D5.C 18.12,41.72 18.47,42.07 v18.47,42.8 | v18.47,42.8 18.34,42.93 18.34,43.23 v17.88,43.69 17.88,43.38 v17.4,42.9 | v17.4,42.9 17.5,42.8 v18.47,42.8 | v17.4,42.9 18.12,42.18 D5.C
  Top 1.27: 16.59,32 v16.59,32.97 15.19,32.97 L31.P$1 13.95,31.73 9.65,31.73 C31.2 9.5,31.37 9.5,29.28 | v16.56,32 15.04,32
  Bottom 0.406: v25.93,18.44 21.46,18.44 v21.46,18.85 | v10.67,30.38 7.52,30.38 7.01,29.87 5.89,29.87 4.83,28.8 4.83,27.03 3.23,25.43
  Bottom 0.508: 3.23,25.43 3.23,24.51 v2.95,24.23 | VIN.P$1 VIN'.P$1
  Bottom 1.016: v16.59,32.97 16.59,32 v16.56,32 16.51,32 16,32.51 16,32.94 | v16.59,32.97 16.59,33.53 | 16.46,32.97 v16.59,32.97 | v16.59,32.97 17.02,32.54 | 17.02,32.54 17.02,32.44 | 17.02,32.54 17.02,33.1 | 18.54,42.8 18.44,42.9 v17.4,42.9 17.88,43.38 | v18.47,42.8 17.88,43.38 | 17.88,43.38 v17.88,43.69 18.54,43.03 18.54,42.8 | 18.54,42.8 18.54,42.72 18.54,42.55
  Bottom 1.27: 16.59,33.53 16.59,34.95 | 16,32.51 16.46,32.97 | 17.02,32.44 16.59,32 | 17.02,33.1 16.59,33.53 | 16,32.94 16.59,33.53
  Bottom 1.524: 16.59,34.95 16.59,35.64 18.54,37.59 18.54,40.64 | 18.54,40.64 18.54,42.55 | 18.54,42.72 v18.47,42.8 | VIN.P$1 18.54,40.64
VIN5V  (via drill 0.3)
  Top 0.61: IC5-5V.3 24.82,31.82 25.09,31.55 v25.17,31.55 | IC5-5V.1 22.37,30.2 C51.2 | C51.2 22.22,30.72 v21.46,31.47 21.64,31.29 21.64,30.62 C51.2
  Top 1.016: C51.2 20.72,30.05 D53.K 20.01,26.93 5V-SWITCH.2
  Bottom 0.61: v25.17,31.55 21.54,31.55 v21.46,31.47
VOUT
  Top 0.406: VOUT'.P$1 33.04,23.13 R18.2
  Top 0.508: VOUT.P$1 VOUT'.P$1
  Top 1.016: 24.62,22.86 23.88,22.86 23.88,25.6 5V-SWITCH.1
  Top 1.524: 23.85,8.01 C43.1 23.62,8.24 23.62,21.87 23.85,22.1 24.62,22.86 VOUT.P$1
  Bottom 0.508: VOUT.P$1 VOUT'.P$1
  pour Top (no thermals): 12.27,8.13 12.27,7.06 16.3,7.06 17.91,5.46 25.4,5.46 25.4,8.13
VOUT_MEASURE
  Top 0.406: R17.2 37.03,26.46 38.07,27.49 38.07,28.8 38.81,29.54 43.23,29.54 44.46,30.77 U1.23
  Top 0.508: R17.2 36.26,25.96 R18.1
VREF_2.5V  (via drill 0.3)
  Top 0.406: U1.28 49.38,27.38 51.43,25.33 v51.43,25.17
  Top 0.508: v62.56,29.36 62.56,30.17 VREF_SHUNT.1 63.44,30.04 65.23,30.04 R27.2
  Bottom 0.508: v51.43,25.17 51.43,26.29 56.13,30.99 57.95,30.99 60.2,28.74 61.94,28.74 v62.56,29.36
XTAL1
  Top 0.406: U1.7 55.85,34.77 56.52,35.43 60.73,35.43 61.68,36.38 C3.2 61.52,37.32 61.52,40.74 20MHZ.2
XTAL2
  Top 0.406: 54.11,35.57 55.68,37.13 | C7.2 55.79,39.9 20MHZ.1
  Top 0.508: U1.8 54.11,35.57 | 55.68,37.13 C7.2

## Text on the board
tPlace: SW OFF ON | LIPO / CHARGE BOOST / PROTECT | 3.3V-17V | VBOOST | 5.5V | 3.3V-17V | 0.5A 1.6A | VOUT / 3V-16V | TRANSISTOR COMPONENT TESTER | TEST / BUTTON
bPlace: TS | v1